# EAGLE design ripples_v90 (EAGLE 5.09)
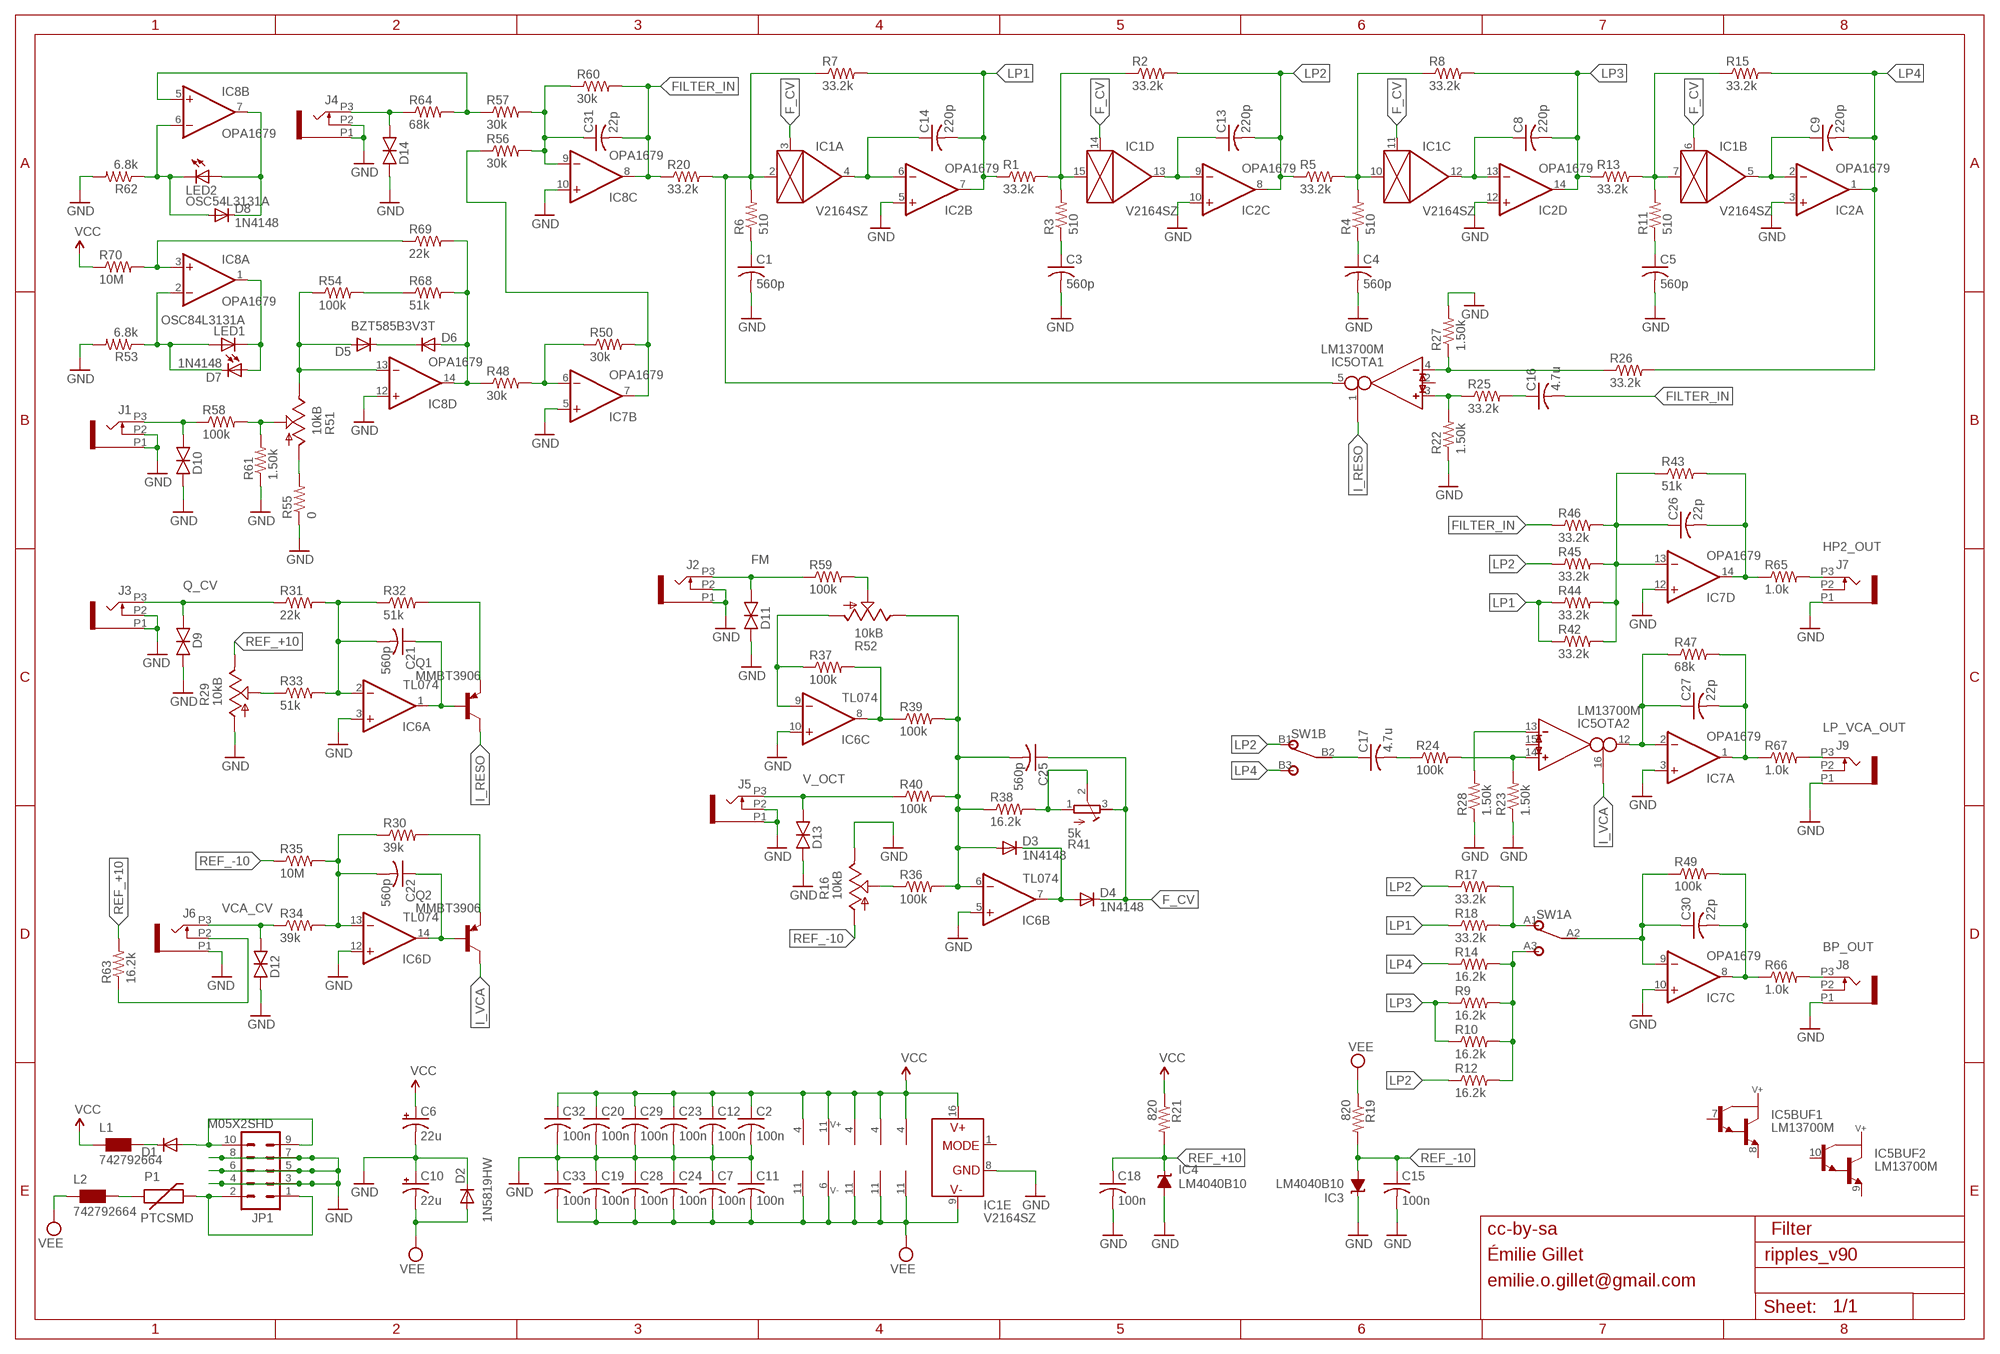
[diagram p0: schematic, sheet 1]

## Parts
C1  560p  C-USC0402  [C0402]
C2  100n  C-USC0402  [C0402]
C3  560p  C-USC0402  [C0402]
C4  560p  C-USC0402  [C0402]
C5  560p  C-USC0402  [C0402]
C6  22u  CPOL-USB  [PANASONIC_B]
C7  100n  C-USC0402  [C0402]
C8  220p  C-USC0603  [C0603]
C9  220p  C-USC0603  [C0603]
C10  22u  CPOL-USB  [PANASONIC_B]
C11  100n  C-USC0402  [C0402]
C12  100n  C-USC0402  [C0402]
C13  220p  C-USC0603  [C0603]
C14  220p  C-USC0603  [C0603]
C15  100n  C-USC0402  [C0402]
C16  4.7u  C-USC1206  [C1206]
C17  4.7u  C-USC1206  [C1206]
C18  100n  C-USC0402  [C0402]
C19  100n  C-USC0402  [C0402]
C20  100n  C-USC0402  [C0402]
C21  560p  C-USC0402  [C0402]
C22  560p  C-USC0402  [C0402]
C23  100n  C-USC0402  [C0402]
C24  100n  C-USC0402  [C0402]
C25  560p  C-USC0402  [C0402]
C26  22p  C-USC0402  [C0402]
C27  22p  C-USC0402  [C0402]
C28  100n  C-USC0402  [C0402]
C29  100n  C-USC0402  [C0402]
C30  22p  C-USC0402  [C0402]
C31  22p  C-USC0402  [C0402]
C32  100n  C-USC0402  [C0402]
C33  100n  C-USC0402  [C0402]
D1  1N5819HW  DIODE-SOD123  [SOD123]
D2  1N5819HW  DIODE-SOD123  [SOD123]
D3  1N4148  DIODE-SOD523  [SOD523]
D4  1N4148  DIODE-SOD523  [SOD523]
D5  BZT585B3V3T  DIODE-SOD523  [SOD523]
D6  BZT585B3V3T  DIODE-SOD523  [SOD523]
D7  1N4148  DIODE-SOD523  [SOD523]
D8  1N4148  DIODE-SOD523  [SOD523]
D9  TVS  [0603]
D10  TVS  [0603]
D11  TVS  [0603]
D12  TVS  [0603]
D13  TVS  [0603]
D14  TVS  [0603]
IC1  V2164SZ  SSM2164S  [SOIC16N]
IC2  OPA1679  OPA1679PW  [TSSOP14_065]
IC3  LM4040B10  LM4041B12DBZ  [DBZ_R-PDSO-G3]
IC4  LM4040B10  LM4041B12DBZ  [DBZ_R-PDSO-G3]
IC5  LM13700M  [SO16]
IC6  TL074  TL074PW  [TSSOP14_065]
IC7  OPA1679  OPA1679PW  [TSSOP14_065]
IC8  OPA1679  OPA1679PW  [TSSOP14_065]
J1  PJ301_THONKICONNTME  [WQP_PJ_301M_TME]
J2  PJ301_THONKICONNTME  [WQP_PJ_301M_TME]
J3  PJ301_THONKICONNTME  [WQP_PJ_301M_TME]
J4  PJ301_THONKICONNTME  [WQP_PJ_301M_TME]
J5  PJ301_THONKICONNTME  [WQP_PJ_301M_TME]
J6  PJ301_THONKICONNTME  [WQP_PJ_301M_TME]
J7  PJ301_THONKICONNTME  [WQP_PJ_301M_TME]
J8  PJ301_THONKICONNTME  [WQP_PJ_301M_TME]
J9  PJ301_THONKICONNTME  [WQP_PJ_301M_TME]
JP1  M05X2SHD  [2X5-SHROUDED]
L1  742792664  WE-CBF_0603  [0603]
L2  742792664  WE-CBF_0603  [0603]
LED1  OSC84L3131A  LED3MM  [LED3MM]
LED2  OSC54L3131A  LED3MM  [LED3MM]
P1  PTCSMD  [PTC-1206]
Q1  MMBT3906  MMBT3906LT1-PNP-SOT23-BEC  [SOT23-BEC]
Q2  MMBT3906  MMBT3906LT1-PNP-SOT23-BEC  [SOT23-BEC]
R1  33.2k  R-US_R0402  [R0402]
R2  33.2k  R-US_R0402  [R0402]
R3  510  R-US_R0402  [R0402]
R4  510  R-US_R0402  [R0402]
R5  33.2k  R-US_R0402  [R0402]
R6  510  R-US_R0402  [R0402]
R7  33.2k  R-US_R0402  [R0402]
R8  33.2k  R-US_R0402  [R0402]
R9  16.2k  R-US_R0402  [R0402]
R10  16.2k  R-US_R0402  [R0402]
R11  510  R-US_R0402  [R0402]
R12  16.2k  R-US_R0402  [R0402]
R13  33.2k  R-US_R0402  [R0402]
R14  16.2k  R-US_R0402  [R0402]
R15  33.2k  R-US_R0402  [R0402]
R16  10kB  POT_USVERTICAL_PS  [ALPS_POT_VERTICAL_PS]
R17  33.2k  R-US_R0402  [R0402]
R18  33.2k  R-US_R0402  [R0402]
R19  820  R-US_R0402  [R0402]
R20  33.2k  R-US_R0402  [R0402]
R21  820  R-US_R0402  [R0402]
R22  1.50k  R-US_R0402  [R0402]
R23  1.50k  R-US_R0402  [R0402]
R24  100k  R-US_R0402  [R0402]
R25  33.2k  R-US_R0402  [R0402]
R26  33.2k  R-US_R0402  [R0402]
R27  1.50k  R-US_R0402  [R0402]
R28  1.50k  R-US_R0402  [R0402]
R29  10kB  POT_USVERTICAL_PS  [ALPS_POT_VERTICAL_PS]
R30  39k  R-US_R0402  [R0402]
R31  22k  R-US_R0402  [R0402]
R32  51k  R-US_R0402  [R0402]
R33  51k  R-US_R0402  [R0402]
R34  39k  R-US_R0402  [R0402]
R35  10M  R-US_R0402  [R0402]
R36  100k  R-US_R0402  [R0402]
R37  100k  R-US_R0402  [R0402]
R38  16.2k  R-US_R0402  [R0402]
R39  100k  R-US_R0402  [R0402]
R40  100k  R-US_R0402  [R0402]
R41  5k  R-TRIMM3296X  [RTRIM3296X]
R42  33.2k  R-US_R0402  [R0402]
R43  51k  R-US_R0402  [R0402]
R44  33.2k  R-US_R0402  [R0402]
R45  33.2k  R-US_R0402  [R0402]
R46  33.2k  R-US_R0402  [R0402]
R47  68k  R-US_R0402  [R0402]
R48  30k  R-US_R0402  [R0402]
R49  100k  R-US_R0402  [R0402]
R50  30k  R-US_R0402  [R0402]
R51  10kB  POT_USVERTICAL_NARROW  [ALPS_POT_NARROW]
R52  10kB  POT_USVERTICAL_NARROW  [ALPS_POT_NARROW]
R53  6.8k  R-US_R0402  [R0402]
R54  100k  R-US_R0402  [R0402]
R55  0  R-US_R0402  [R0402]
R56  30k  R-US_R0402  [R0402]
R57  30k  R-US_R0402  [R0402]
R58  100k  R-US_R0402  [R0402]
R59  100k  R-US_R0402  [R0402]
R60  30k  R-US_R0402  [R0402]
R61  1.50k  R-US_R0402  [R0402]
R62  6.8k  R-US_R0402  [R0402]
R63  16.2k  R-US_R0402  [R0402]
R64  68k  R-US_R0402  [R0402]
R65  1.0k  R-US_R0603  [R0603]
R66  1.0k  R-US_R0603  [R0603]
R67  1.0k  R-US_R0603  [R0603]
R68  51k  R-US_R0402  [R0402]
R69  22k  R-US_R0402  [R0402]
R70  10M  R-US_R0402  [R0402]
SW1  S-ON-ON-ONSS70070F-0202  [SS70070F-0202]

## Nets
BP__OUT: C30.2 IC7.8(C:OUT) R49.2 R66.1
BP_OUT: J8.P3 R66.2
CLEAN_IN: IC8.5(B:+IN) R57.1 R64.2
CV_F_POT: R16.P$2(S) R36.1
DIRTY_IN: D6.A IC8.14(D:OUT) R48.1 R68.2 R69.2
F_CV: C25.1 D4.C IC1.3(A:CTRL) IC1.6(B:CTRL) IC1.11(C:CTRL) IC1.14(D:CTRL) R41.3(A)
FILTER_IN: C16.2 C31.2 IC8.8(C:OUT) R20.1 R46.1 R60.2
FM: D11.2(C) J2.P3 R59.1
GND: C1.2 C2.2 C3.2 C4.2 C5.2 C6.- C7.1 C10.+ C11.1 C12.2 C15.2 C18.2 C19.1 C20.2 C23.2 C24.1 C28.1 C29.2 C32.2 C33.1 D2.C D9.1(A) D10.1(A) D11.1(A) D12.1(A) D13.1(A) D14.1(A) IC1.8(E:GND) IC2.3(A:+IN) IC2.5(B:+IN) IC2.10(C:+IN) IC2.12(D:+IN) IC3.1(C) IC4.2(A) IC6.3(A:+IN) IC6.5(B:+IN) IC6.10(C:+IN) IC6.12(D:+IN) IC7.3(A:+IN) IC7.5(B:+IN) IC7.10(C:+IN) IC7.12(D:+IN) IC8.10(C:+IN) IC8.12(D:+IN) J1.P1 J1.P2 J2.P1 J2.P2 J3.P1 J3.P2 J4.P1 J4.P2 J5.P1 J5.P2 J6.P1 J7.P1 J8.P1 J9.P1 JP1.3 JP1.4 JP1.5 JP1.6 JP1.7 JP1.8 R16.P$1(E) R22.1 R23.1 R27.2 R28.1 R29.P$3(A) R53.2 R55.1 R61.1 R62.2
HP2__OUT: C26.2 IC7.14(D:OUT) R43.2 R65.1
HP2_OUT: J7.P3 R65.2
I_RESO: IC5.1(OTA1:I_BIAS) Q1.C
I_VCA: IC5.16(OTA2:I_BIAS) Q2.C
LP1: C14.2 IC2.7(B:OUT) R1.1 R7.2 R18.1 R42.1 R44.1
LP2: C13.2 IC2.8(C:OUT) R2.2 R5.1 R12.1 R17.1 R45.1 SW1.B1
LP3: C8.2 IC2.14(D:OUT) R8.2 R9.1 R10.1 R13.1
LP4: C9.2 IC2.1(A:OUT) R14.1 R15.2 R26.2 SW1.B3
LP_VARIABLE: C17.1 SW1.B2
LP_VCA__OUT: C27.2 IC7.1(A:OUT) R47.2 R67.1
LP_VCA_OUT: J9.P3 R67.2
N$1: IC6.8(C:OUT) R37.2 R39.1
N$2: C14.1 IC1.4(A:OUT) IC2.6(B:-IN)
N$3: IC1.15(D:IN) R1.2 R2.1 R3.2
N$4: R38.2 R41.1(E) R41.2(S)
N$5: IC7.6(B:-IN) R48.2 R50.1
N$6: D1.A JP1.9 JP1.10
N$7: C16.1 R25.2
N$8: C1.1 R6.1
N$9: C13.1 IC1.13(D:OUT) IC2.9(C:-IN)
N$10: IC1.2(A:IN) IC5.5(OTA1:OUT) R6.2 R7.1 R20.2
N$11: C3.1 R3.1
N$12: IC1.10(C:IN) R4.2 R5.2 R8.1
N$13: C8.1 IC1.12(C:OUT) IC2.13(D:-IN)
N$14: IC5.4(OTA1:IN_N) R26.1 R27.1
N$15: C4.1 R4.1
N$16: IC1.7(B:IN) R11.2 R13.2 R15.1
N$17: C9.1 IC1.5(B:OUT) IC2.2(A:-IN)
N$18: IC5.3(OTA1:IN_P) R22.2 R25.1
N$19: C5.1 R11.1
N$20: C26.1 IC7.13(D:-IN) R42.2 R43.1 R44.2 R45.2 R46.2
N$21: R52.P$2(S) R59.2
N$22: IC6.9(C:-IN) R37.1 R52.P$3(A)
N$23: C25.2 D3.A IC6.6(B:-IN) R36.2 R38.1 R39.2 R40.2 R52.P$1(E)
N$24: R29.P$2(S) R33.1
N$25: C22.2 IC6.13(D:-IN) R30.1 R34.2 R35.2
N$26: C21.2 IC6.2(A:-IN) R31.2 R32.1 R33.2
N$27: C21.1 IC6.1(A:OUT) Q1.B
N$28: Q1.E R32.2
N$29: J6.P2 R63.1
N$30: C22.1 IC6.14(D:OUT) Q2.B
N$31: Q2.E R30.2
N$32: R51.P$3(A) R55.2
N$33: D7.A IC8.1(A:OUT) LED1.K(C)
N$34: JP1.1 JP1.2 P1.2
N$35: R54.2 R68.1
N$36: D10.2(C) J1.P3 R58.1
N$37: D7.C IC8.2(A:-IN) LED1.A R53.1
N$38: D3.C D4.A IC6.7(B:OUT)
N$39: IC7.7(B:OUT) R50.2 R56.1
N$40: C30.1 IC7.9(C:-IN) R49.1 SW1.A2
N$41: IC8.3(A:+IN) R69.1 R70.2
N$42: IC5.14(OTA2:IN_P) R23.2 R24.2
N$43: C27.1 IC5.12(OTA2:OUT) IC7.2(A:-IN) R47.1
N$45: R51.P$2(S) R58.2 R61.2
N$46: D5.C D6.C
N$47: IC5.13(OTA2:IN_N) R28.2
N$48: D1.C L1.2
N$50: L2.2 P1.1
N$51: D14.2(C) J4.P3 R64.1
N$52: C31.1 IC8.9(C:-IN) R56.2 R57.2 R60.1
N$53: D8.C IC8.7(B:OUT) LED2.A
N$54: D8.A IC8.6(B:-IN) LED2.K(C) R62.1
N$57: R17.2 R18.2 SW1.A1
N$58: R9.2 R10.2 R12.2 R14.2 SW1.A3
N$68: C17.2 R24.1
N$108: D5.A IC8.13(D:-IN) R51.P$1(E) R54.1
Q_CV: D9.2(C) J3.P3 R31.1
REF_+10: C18.1 IC4.1(C) R21.2 R29.P$1(E) R63.2
REF_-10: C15.1 IC3.2(A) R16.P$3(A) R19.2 R35.1
V_OCT: D13.2(C) J5.P3 R40.1
VCA_CV: D12.2(C) J6.P3 R34.1
VCC: C2.1 C6.+ C12.1 C20.1 C23.1 C29.1 C32.1 IC1.16(E:V+) IC2.4(P:V+) IC5.11(SUPPLY:V+) IC6.4(P:V+) IC7.4(P:V+) IC8.4(P:V+) L1.1 R21.1 R70.1
VEE: C7.2 C10.- C11.2 C19.2 C24.2 C28.2 C33.2 D2.A IC1.9(E:V-) IC2.11(P:V-) IC5.6(SUPPLY:V-) IC6.11(P:V-) IC7.11(P:V-) IC8.11(P:V-) L2.1 R19.1
Unconnected: IC1.1(E:MODE) IC5.2(OTA1:I_DIODE) IC5.7(BUF1:B) IC5.8(BUF1:E) IC5.9(BUF2:E) IC5.10(BUF2:B) IC5.15(OTA2:I_DIODE) J7.P2 J8.P2 J9.P2

## Notes on the sheet
- cc-by-sa | Filter
- Émilie Gillet
- emilie.o.gillet@gmail.com

## Library data of the parts
C1-C5 C7-C9 C11-C33 = rcl:C-US: CAPACITOR, American symbol
C6 C10 = rcl:CPOL-US: POLARIZED CAPACITOR, American symbol
D1-D8 = diode:DIODE-: DIODE
D9-D14 = og-diodes:TVS
IC1 = ssm2164:SSM2164
IC2 IC7 IC8 = og-linear:OPA1679
IC3 IC4 = texas:LM4041: PRECISION MICROPOWER SHUNT VOLTAGE REFERENCE Source: http://focus.ti.com/lit/ds/slcs146e/slcs146e.pdf
IC5 = ota:LM13700: Dual OTA with buffers
IC6 = og-linear:TL074: OP AMP
J1-J9 = og-pj301:PJ301_THONKICONN
JP1 = og-header:M05X2: Header 5x2 Standard 10-pin dual row 0.1" header. Commonly used with AVR-ISP. Use with Spark Fun Electronics SKU: PRT-00778
L1 L2 = wuerth-elektronik:WE-CBF: SMD EMI Suppression Ferrite Beads - excellent anti-EMI properties - low DCR - impedances till 3000 ohms - rated current up to 6 A
LED1 LED2 = led:LED: LED OSRAM: - CHIPLED LG R971, LG N971, LY N971, LG Q971, LY Q971, LO R971, LY R971 LH N974, LH R974 LS Q976, LO Q976, LY Q976 LO Q996 - Hyper CHIPLED LW Q18S LB Q993, LB Q99A, LB R99A - SideLED LS A670, LO A670, LY A670, LG A670, LP A670 LB A673, LV A673, LT A673, LW A673 LH A674 LY A675 LS A676, LA A676, LO A676, LY A676, LW A676 LS A679, LY A679, LG A679 - Hyper Micro SIDELED® LS Y876, LA Y876, LO Y876, LY Y876 LT Y87S - SmartLED LW L88C, LW L88S LB L89C, LB L89S, LG L890 LS L89K, LO L89K, LY L89K LS L896, LA L896, LO L896, LY L896 - TOPLED LS T670, LO T670, LY T670, LG T670, LP T670 LSG T670, LSP T670, LSY T670, LOP T670, LYG T670 LG T671, LOG T671, LSG T671 LB T673, LV T673, LT T673, LW T673 LH T674 LS T676, LA T676, LO T676, LY T676, LB T676, LH T676, LSB T676, LW T676 LB T67C, LV T67C, LT T67C, LS T67K, LO T67K, LY T67K, LW E67C LS E67B, LA E67B, LO E67B, LY E67B, LB E67C, LV E67C, LT E67C LW T67C LS T679, LY T679, LG T679 LS T770, LO T770, LY T770, LG T770, LP T770 LB T773, LV T773, LT T773, LW T773 LH T774 LS E675, LA E675, LY E675, LS T675 LS T776, LA T776, LO T776, LY T776, LB T776 LHGB T686 LT T68C, LB T68C - Hyper Mini TOPLED® LB M676 - Mini TOPLED Santana® LG M470 LS M47K, LO M47K, LY M47K Source: http://www.osram.convergy.de LUXEON: - LUMILED® LXK2-PW12-R00, LXK2-PW12-S00, LXK2-PW14-U00, LXK2-PW14-V00 LXK2-PM12-R00, LXK2-PM12-S00, LXK2-PM14-U00 LXK2-PE12-Q00, LXK2-PE12-R00, LXK2-PE12-S00, LXK2-PE14-T00, LXK2-PE14-U00 LXK2-PB12-K00, LXK2-PB12-L00, LXK2-PB12-M00, LXK2-PB14-N00, LXK2-PB14-P00, LXK2-PB14-Q00 LXK2-PR12-L00, LXK2-PR12-M00, LXK2-PR14-Q00, LXK2-PR14-R00 LXK2-PD12-Q00, LXK2-PD12-R00, LXK2-PD12-S00 LXK2-PH12-R00, LXK2-PH12-S00 LXK2-PL12-P00, LXK2-PL12-Q00, LXK2-PL12-R00 Source: www.luxeon.com KINGBRIGHT: KA-3528ASYC Source: www.kingbright.com
P1 = SparkFun:PTC: Resettable Fuse PTC Resettable Fuse. Spark Fun Electronics SKU : COM-08357
Q1 Q2 = transistor:*-PNP-: PNP Transistror
R1-R15 R17 R18 R20-R28 R30-R40 R42-R50 R53-R70 = rcl:R-US_: RESISTOR, American symbol
R16 R29 R51 R52 = og-pots:POT_US
R19 = resistor:R-US_: RESISTOR, American symbol
R41 = rcl:R-TRIMM: Trimm resistor
SW1 = og-switch:S-ON-ON-ON

## Board
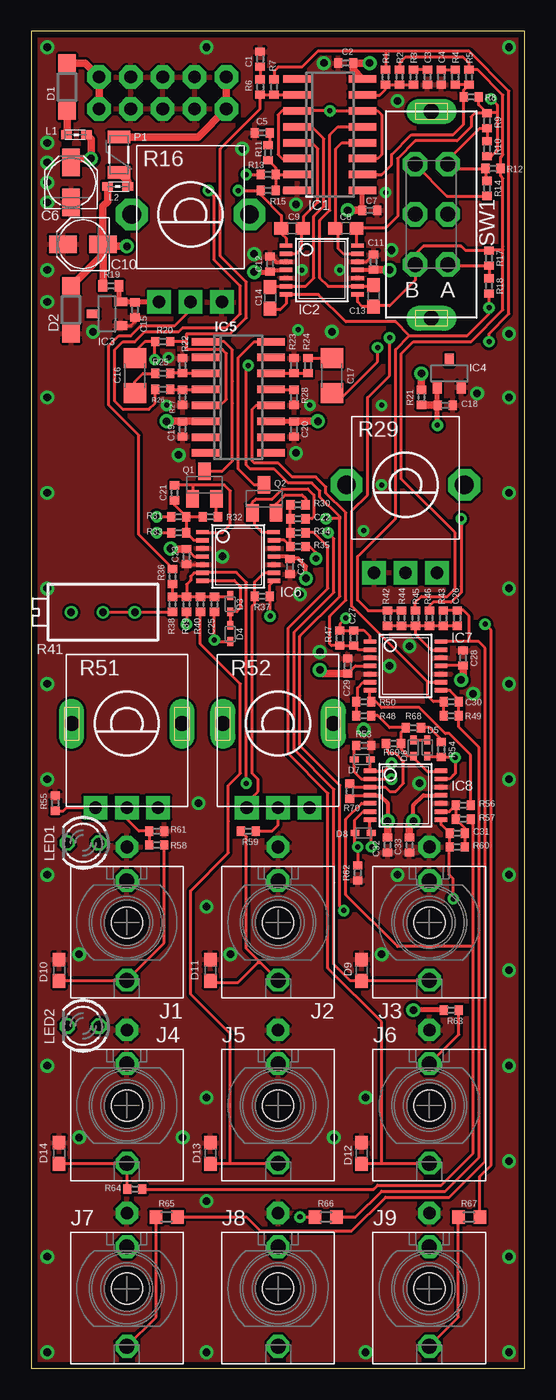
[diagram p1: board, top side]
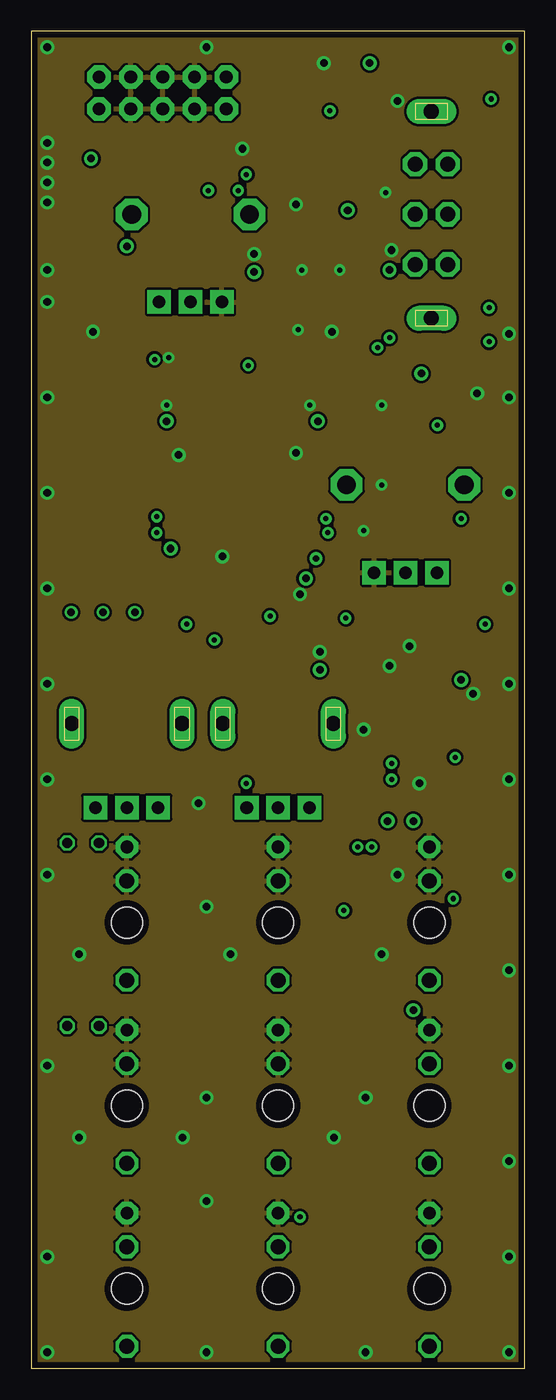
[diagram p2: board, inner layer InternalGround]
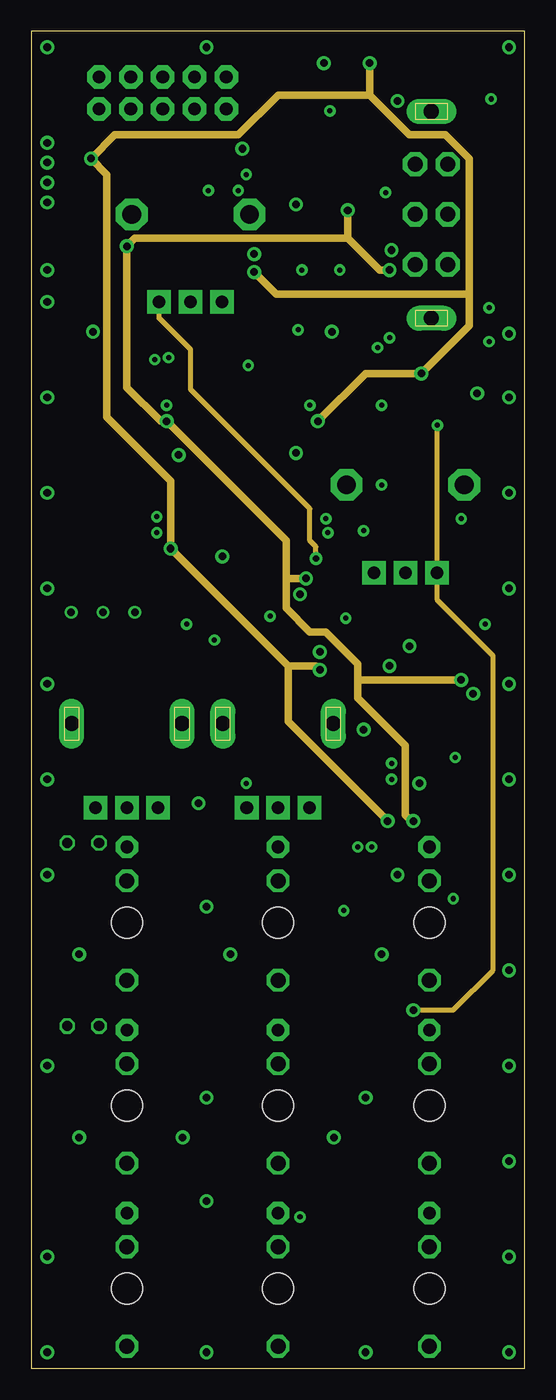
[diagram p3: board, inner layer Supplies]
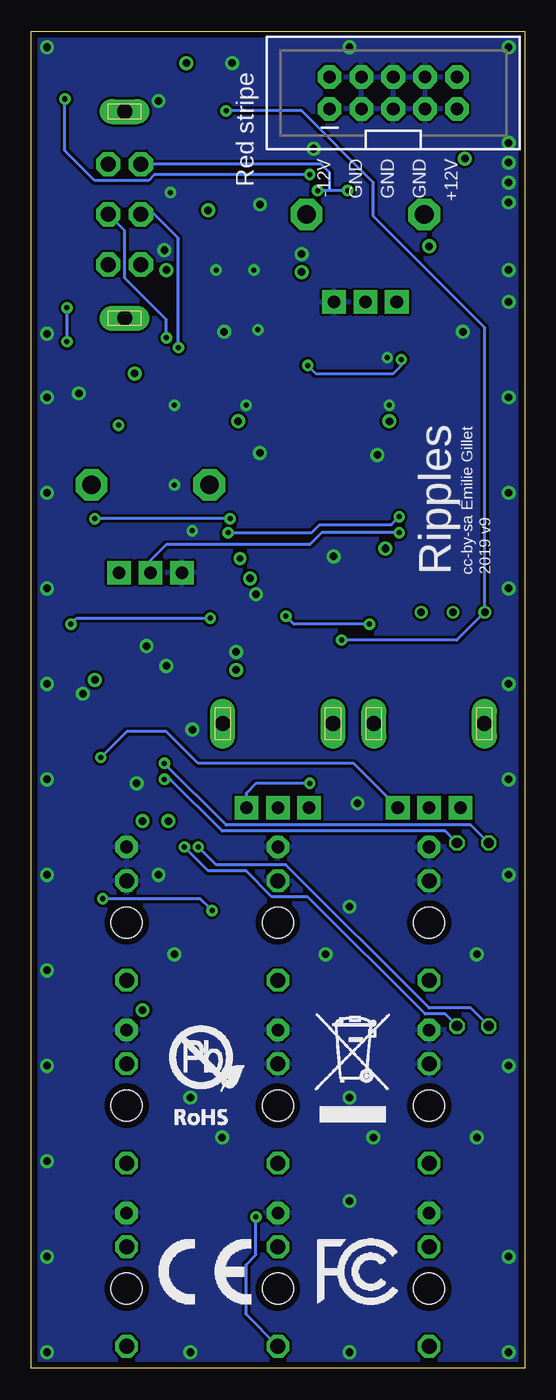
[diagram p4: board, bottom side, seen from below]

Size 39.35 x 106.68 mm. Coordinates in mm from the lower left corner, seen from the top.
Outline: 0,0 39.35,0 39.35,106.68 0,106.68 0,0
Copper layers (1+2*15+16): Top 0.05mm / dielectric 0.3mm / InternalGround 0.05mm / dielectric 0.75mm / Supplies 0.035mm / dielectric 0.2mm / Bottom 0.05mm
Design rules "PCBCart-Standard-4L *": minimum track width 8mil, minimum drill 0.3mm, track to track 8mil, track to pad 8mil, pad to pad 8mil, via to via 8mil, smd to smd 8mil, copper to edge 20mil, drill to drill 8mil, minimum pad ring 8mil, minimum via ring 10mil, stop-mask expansion 3mil, vias tented up to drill 25mil, thermal gap 8mil

### Footprints (pad centres in the part's own frame; a part is rotated, then mirrored left to right if it is on the bottom)
C0402 = smd 0.65 x 0.75: 1 -0.6,0; 2 0.6,0
PANASONIC_B = smd 2.2 x 1.4: + 1.6,0; - -1.6,0
C0603 = smd 1.1 x 1: 1 -0.85,0; 2 0.85,0
C1206 = smd 1.6 x 1.8: 1 -1.4,0; 2 1.4,0
SOD123 = smd 1.4 x 1.4: A 1.9,0; C -1.9,0
SOD523 = smd 0.7 x 0.5: A 0.7,0; C -0.6,0
0603 = smd 1.1 x 1: 1 -0.85,0; 2 0.85,0
SOIC16N = smd 0.6 x 2.2: 1 -4.445,-2.6; 2 -3.175,-2.6; 3 -1.905,-2.6; 4 -0.635,-2.6; 5 0.635,-2.6; 6 1.905,-2.6; 7 3.175,-2.6; 8 4.445,-2.6; 9 4.445,2.6; 10 3.175,2.6; 11 1.905,2.6; 12 0.635,2.6; 13 -0.635,2.6; 14 -1.905,2.6; 15 -3.175,2.6; 16 -4.445,2.6
TSSOP14_065 = smd 0.35 x 1: 1 -1.95,-2.845; 2 -1.3,-2.845; 3 -0.65,-2.845; 4 0,-2.845; 5 0.65,-2.845; 6 1.3,-2.845; 7 1.95,-2.845; 8 1.95,2.845; 9 1.3,2.845; 10 0.65,2.845; 11 0,2.845; 12 -0.65,2.845; 13 -1.3,2.845; 14 -1.95,2.825
DBZ_R-PDSO-G3 = smd 0.7 x 1: 1 -0.95,-1.1; 2 0.95,-1.1; 3 0,1.1
SO16 = smd 0.6 x 2.2: 1 -4.445,-2.6; 2 -3.175,-2.6; 3 -1.905,-2.6; 4 -0.635,-2.6; 5 0.635,-2.6; 6 1.905,-2.6; 7 3.175,-2.6; 8 4.445,-2.6; 9 4.445,2.6; 10 3.175,2.6; 11 1.905,2.6; 12 0.635,2.6; 13 -0.635,2.6; 14 -1.905,2.6; 15 -3.175,2.6; 16 -4.445,2.6
WQP_PJ_301M_TME = drill 1 pad 1.778 octagon: P1 0,-6.032 | drill 1.2 pad 1.778 octagon: P2 0,-3.334; P3 0,4.604 | hole 2.5: 0,0
2X5-SHROUDED = drill 1.016 pad 1.88 octagon: 1 -1.27,5.08; 2 1.27,5.08; 3 -1.27,2.54; 4 1.27,2.54; 5 -1.27,0; 6 1.27,0; 7 -1.27,-2.54; 8 1.27,-2.54; 9 -1.27,-5.08; 10 1.27,-5.08
0603' = smd 0.85 x 0.7: 1 -0.9,0; 2 0.7,0
LED3MM = drill 0.813 octagon: A -1.27,0; K 1.27,0
PTC-1206 = smd 1 x 1.8: 1 -1.4,0; 2 1.4,0
SOT23-BEC = smd 1 x 1.4: B -0.95,-1.1; C 0,1.1; E 0.95,-1.1
R0402 = smd 0.65 x 0.75: 1 -0.6,0; 2 0.6,0
ALPS_POT_VERTICAL_PS = drill 1 pad 1.88 square: P$1 -2.5,7; P$2 0,7; P$3 2.5,7 | drill 1.5 pad 2.54 octagon: P$4 -4.7,0; P$5 4.7,0
R0402' = smd 0.7 x 0.9: 1 -0.65,0; 2 0.65,0
RTRIM3296X = drill 0.61 round: 1 0,-2.54; 2 0,0; 3 0,2.54
ALPS_POT_NARROW = drill 1 pad 1.88 square: P$1 -2.5,6.7; P$2 0,6.7; P$3 2.5,6.7 | drill 1.2 pad 2 long: P$4 -4.4,0; P$5 4.4,0
R0603 = smd 1 x 1.1: 1 -0.85,0; 2 0.85,0
SS70070F-0202 = drill 1.2 pad 1.93 octagon: A1 -1.3,4; A2 -1.3,0; A3 -1.3,-4; B1 1.3,4; B2 1.3,0; B3 1.3,-4 | drill 1.2 pad 2 long: P$1 0,-8.21; P$4 0,8.3

### Placement (x,y rotation side)
C1  18.26,104.46 90 top
C2  25.08,104.14 180 top
C3  31.59,103.03 270 top
C4  32.7,103.03 270 top
C5  18.41,98.58 180 top
C6  3.17,94.61 90 top
C7  26.99,92.39 180 top
C8  25.08,90.96 0 top
C9  20.8,90.96 180 top
C10  4.13,89.69 180 top
C11  27.31,88.27 270 top
C12  19.05,88.11 90 top
C13  27.3,85.57 270 top
C14  19.05,85.41 270 top
C15  8.26,84.45 270 top
C16  8.26,79.22 90 top
C17  23.97,79.22 90 top
C18  33.02,76.83 0 top
C19  12.06,74.93 90 top
C20  20.95,74.93 270 top
C21  11.43,69.85 270 top
C22  21.27,67.79 180 top
C23  12.38,64.77 270 top
C24  20.64,63.98 90 top
C25  14.61,60.96 90 top
C26  33.97,59.85 90 top
C27  25.72,58.26 90 top
C28  34.45,56.67 270 top
C29  25.24,56.04 90 top
C30  33.5,53.18 0 top
C31  33.97,42.7 180 top
C32  28.42,41.75 270 top
C33  30.16,41.75 90 top
D1  2.86,102.23 90 top
D2  3.17,84.45 90 top
D3  15.88,60.96 90 top
D4  15.88,58.58 90 top
D5  31.59,49.53 270 top
D6  30.48,49.53 270 top
D7  26.35,48.58 0 top
D8  26.51,42.7 180 top
D9  26.35,31.75 270 top
D10  2.22,31.75 270 top
D11  14.29,31.75 270 top
D12  26.35,17.15 270 top
D13  14.29,17.14 270 top
D14  2.22,17.14 270 top
IC1  23.81,98.42 270 top
IC2  23.18,87.63 270 top
IC3  6.03,84.14 90 top
IC4  33.34,79.38 0 top
IC5  16.51,77.47 270 top
IC6  16.51,64.77 270 top
IC7  29.84,56.04 270 top
IC8  29.84,45.72 270 top
J1  7.62,35.56 180 top
J2  19.68,35.56 180 top
J3  31.75,35.56 180 top
J4  7.62,20.95 180 top
J5  19.68,20.95 180 top
J6  31.75,20.95 180 top
J7  7.62,6.35 180 top
J8  19.68,6.35 180 top
J9  31.75,6.35 180 top
JP1  10.48,101.76 90 bottom
L1  742792664  [0603']  3.49,98.43 180 top
L2  742792664  [0603']  6.99,94.3 0 top
LED1  4.13,41.91 180 top
LED2  4.13,27.3 180 top
P1  6.99,96.84 90 top
Q1  13.81,70.48 0 top
Q2  18.57,69.37 0 top
R1  28.26,103.03 270 top
R2  29.37,103.03 90 top
R3  30.48,103.03 270 top
R4  33.81,103.03 270 top
R5  34.92,103.03 270 top
R6  18.26,102.24 270 top
R7  19.37,102.23 90 top
R8  35.08,101.44 0 top
R9  36.35,99.54 270 top
R10  36.35,97.31 90 top
R11  18.89,97 270 top
R12  36.83,95.73 180 top
R13  18.89,95.25 0 top
R14  36.35,94.14 90 top
R15  18.89,93.98 180 top
R16  12.7,92.08 180 top
R17  36.51,88.58 270 top
R18  36.51,86.36 90 top
R19  820  [R0402']  6.35,86.36 0 top
R20  10.48,81.92 0 top
R21  31.11,77.47 270 top
R22  12.06,80.01 270 top
R23  20.95,80.01 270 top
R24  22.07,80.01 270 top
R25  10.48,79.38 180 top
R26  10.48,78.11 180 top
R27  12.06,77.47 270 top
R28  20.95,77.47 90 top
R29  29.84,70.48 180 top
R30  21.27,68.9 0 top
R31  11.75,67.94 0 top
R32  14.29,67.94 0 top
R33  11.75,66.67 0 top
R34  21.27,66.67 180 top
R35  21.27,65.56 180 top
R36  11.27,63.18 270 top
R37  18.41,61.59 0 top
R38  11.27,60.96 270 top
R39  12.38,60.96 90 top
R40  13.49,60.96 90 top
R41  5.71,60.33 90 top
R42  28.42,59.85 270 top
R43  32.86,59.85 90 top
R44  29.53,59.85 270 top
R45  30.64,59.85 270 top
R46  31.75,59.85 270 top
R47  24.61,58.26 90 top
R48  26.51,52.07 180 top
R49  33.5,52.07 0 top
R50  26.51,53.18 0 top
R51  7.62,51.44 180 top
R52  19.68,51.44 180 top
R53  26.51,49.69 0 top
R54  32.7,49.37 90 top
R55  1.91,45.09 270 top
R56  34.45,44.93 180 top
R57  34.45,43.82 180 top
R58  10,41.75 180 top
R59  17.3,42.86 0 top
R60  33.97,41.59 180 top
R61  10,42.86 180 top
R62  26.04,39.53 270 top
R63  33.5,28.57 180 top
R64  8.26,14.29 0 top
R65  10.79,12.06 180 top
R66  23.5,12.06 180 top
R67  34.92,12.06 180 top
R68  30.48,51.12 180 top
R69  28.89,49.85 0 top
R70  25.4,46.04 90 top
SW1  31.91,92.08 180 top
U$1  [CE_MEDIUM]  29.21,5.08 0 bottom
U$2  [FCC_MEDIUM]  16.51,5.08 0 bottom
U$3  [ROHS_LOGO]  27.94,19.37 0 bottom
U$4  [TRASHCAN_LOGO]  16.51,19.37 0 bottom

### Tracks (layer width: path | path; a pad name or v marks a point on that pad's centre or on a via)
BP__OUT
  Top 0.254: R66.1 25.88,12.06 27.94,14.13 33.02,14.13 35.72,16.83 | 32.7,54.08 IC7.8 33.38,54.09 33.97,53.5 33.97,53.3 C30.2 R49.2 | 35.72,16.83 | R49.2 | R49.2 34.1,51.15 35.72,49.53 35.72,18.26 35.72,16.83
BP_OUT  (via drill 0.4)
  Top 0.254: v21.43,12.06 R66.2
  Bottom 0.254: v21.43,12.06 21.43,9.05 22.23,8.26 22.23,4.29 J8.P3
CLEAN_IN
  Top 0.254: 35.24,43.62 R57.1 35.05,43.53 35.24,43.34 35.24,33.66 | IC8.5 26.34,45.07 25.08,43.81 25.08,37.78 29.21,33.66 35.24,33.66 | R64.2 27.3,14.29 27.62,14.61 32.7,14.61 35.24,17.14 35.24,33.66
CV_F_POT
  Top 0.254: R36.1 11.27,63.82 10.32,64.77 8.57,66.52 8.57,74.45 6.19,76.83 6.19,81.6 6.99,82.39 7.94,82.39 8.73,83.19 11.43,83.19 12.7,84.45 R16.P$2
DIRTY_IN
  Top 0.254: R48.1 | R48.1 27.62,52.07 28.57,51.12 R68.2 29.49,50.73 R69.2 29.49,49.41 30,48.9 30.41,48.9 D6.A 30.48,48.74 31.59,47.62 32.62,47.62 IC8.14
F_CV  (via drill 0.4)
  Top 0.254: IC1.6 20,96.52 19.68,96.84 19.68,100.01 20,100.33 IC1.3 v23.81,100.33 IC1.14 27.62,100.33 27.94,100.01 27.94,96.84 27.62,96.52 IC1.11 | v14.61,58.1 | v14.61,58.1 C25.1 | v14.61,58.1 14.73,57.98 D4.C
  Bottom 0.254: v23.81,100.33 17.78,100.33 12.06,94.61 12.06,91.92 3.17,83.03 R41.3 5.4,58.1 v14.61,58.1
FILTER_IN  (via drill 0.4)
  Top 0.254: v17.3,80.01 17.14,79.85 17.14,72.07 17.46,71.75 19.37,71.75 20.48,70.64 22.38,70.64 23.02,70.01 23.02,69.53 24.61,67.94 | 24.61,67.94 24.61,61.59 21.43,58.42 21.43,53.66 21.43,49.69 24.61,46.51 24.61,36.83 v24.92,36.51 | v33.66,37.47 33.66,39.05 33.34,39.37 33.34,41.56 R60.2 | 32.7,43.76 IC8.8 32.69,43.39 C31.2 | C31.2 33.34,42.7 | R60.2 | R60.2 C31.2 | C16.2 8.26,81.12 9.05,81.92 R20.1 9.84,81.88 v9.84,80.49 | v34.29,67.79 34.29,62.39 | 34.29,62.39 34.29,61.91 | v23.5,67.79 23.65,67.79 23.97,67.79 24.61,67.79 24.61,67.94 | R46.1 | R46.1 31.75,60.8 32.07,61.12 33.5,61.12 34.29,61.91 | 34.29,62.39 34.29,61.91
  Bottom 0.254: v17.3,80.01 16.67,79.38 10.48,79.38 9.84,80.01 v9.84,80.49 | v33.66,37.47 25.88,37.47 25.08,36.67 v24.92,36.51 | v34.29,67.79 34.13,67.79 v23.5,67.79
FM
  Top 0.254: R59.1 17.14,42.42 17.14,33.5 18.26,32.38 | 18.26,32.38 J2.P3 | D11.2 14.39,30.8 16.51,30.8 18.1,32.38 18.26,32.38
GND  (via drill 0.4, 0.6)
  Top 0.254: C23.2 12.43,64.12 IC6.5 | C11.1 26.72,88.28 IC2.12 | IC3.1 7.94,83.19 8.26,83.5 C15.2
  Top 0.305: 19.05,88.74 19.53,88.27 20.32,88.27
  other vias: 21.27,82.87 22.23,76.83 21.11,73.03 11.75,72.87 10.95,80.64 10.8,76.83 23.97,82.71 1.27,93.03 1.27,94.61 35.56,77.79 28.57,56.04 30.16,57.63 4.92,82.71 21.43,61.75 15.24,64.77 1.27,96.2 38.1,105.41 38.1,82.55 38.1,77.47 38.1,69.85 38.1,62.23 38.1,54.61 38.1,46.99 38.1,39.37 38.1,31.75 38.1,24.13 38.1,16.51 38.1,8.89 38.1,1.27 26.67,1.27 13.97,1.27 1.27,1.27 1.27,8.89 1.27,24.13 1.27,54.61 1.27,62.23 1.27,77.47 1.27,87.63 1.27,105.41 1.27,97.79 13.97,105.41 13.97,21.59 26.67,21.59 13.97,13.34 13.97,36.83 23.34,104.14 21.59,87.63 24.61,87.63 21.11,92.87 28.73,89.22 17.78,88.9 28.26,93.82 29.21,101.12 16.83,97.31 1.27,69.85 1.27,85.09 23.02,57.15 29.21,39.37 26.51,50.96 1.27,46.99 1.27,39.37 30.96,46.67 27.94,33.02 35.24,53.82 13.34,45.09 15.88,33.02 3.81,33.02 3.81,18.41 12.06,18.41 24.13,18.41 27.94,76.83 26.51,66.83 27.94,70.48
  pour Bottom: 0,106.68 0,0 39.37,0 39.37,106.68
  pour Top: 0,106.68 0,0 39.37,0 39.37,106.68
  pour InternalGround: 0,106.68 0,0 39.37,0 39.37,106.68
HP2__OUT
  Top 0.254: R65.1 17.14,12.06 18.26,10.95 25.56,10.95 28.26,13.65 33.34,13.65 36.2,16.51 36.2,16.67 36.2,57.47 35.67,57.99 34.92,57.99 | 34.92,57.99 IC7.14 | C26.2 | C26.2 33.97,60.48 34.45,60.48 34.92,60.01 34.92,57.99 | C26.2 R43.2
HP2_OUT
  Top 0.254: J7.P3 9.95,4.07 R65.2
I_RESO
  Top 0.254: Q1.C 13.82,71.6 15.24,71.6 16.03,72.39 16.03,76.99 16.03,78.74 16.03,81.28 15.4,81.92 IC5.1
I_VCA
  Top 0.254: 19.21,81.92 IC5.16 17.78,81.92 16.51,80.64 16.51,71.75 17.78,70.48 18.56,70.48 Q2.C
LP1  (via drill 0.4)
  Top 0.254: 19.33,102.87 R7.2 19.37,103.5 19.68,103.82 21.59,103.82 22.86,105.09 28.26,105.09 | 28.26,105.09 R1.1 | 28.26,105.09 34.92,105.09 38.1,101.92 38.1,84.14 36.51,82.55 v36.51,81.92 | C14.2 19.15,84.45 19.84,84.45 20.33,84.94 IC2.7 | IC2.7 20.38,85.72 | R18.1 v36.51,84.61 36.51,84.14 34.77,82.39 30.16,82.39 | 30.16,82.39 29.05,81.28 29.05,67.79 26.04,64.77 26.04,61.28 26.86,60.45 R42.1 | R42.1 | R42.1 R44.1 | 30.16,82.39 29.05,83.5 25.08,83.5 22.91,85.68 IC2.7
  Bottom 0.254: v36.51,84.61 v36.51,81.92
LP2
  Top 0.254: 29.37,104.14 29.84,104.62 32.23,104.62 | IC2.8 26.04,85.67 26.04,85.09 26.41,84.72 C13.2 27.36,84.77 28.57,84.77 30.61,86.81 SW1.B1 30.64,88.11 30.64,88.9 31.27,89.53 34.29,89.53 34.64,89.18 R17.1 36.55,89.22 37.62,89.22 | 32.23,104.62 | 32.23,104.62 34.45,104.62 34.92,104.14 R5.1 35.59,103.63 37.62,101.6 37.62,96.84 37.43,96.64 R12.1 37.43,95.13 37.62,94.93 37.62,89.53 37.62,89.22 | 29.37,104.14 | 29.37,104.14 R2.2 | R45.1 30.64,61.12 31.11,61.59 33.18,61.59 33.81,62.23 33.81,66.67 29.53,70.96 29.53,80.96 30.48,81.92 35.08,81.92 37.62,84.45 37.62,89.22
LP3  (via drill 0.4)
  Top 0.254: IC2.14 25.93,89.65 C8.2 | C8.2 | C8.2 28.26,90.96 29.21,91.92 29.21,96.52 30.64,97.95 33.97,97.95 35.08,99.06 35.08,99.85 35.37,100.14 R9.1 | R8.2 35.68,100.81 R9.1 | v36.67,101.28 37.15,100.81 37.15,100.17 | 37.15,100.17 37.15,97.16 36.71,96.71 R10.1 | R9.1 36.39,100.17 37.15,100.17 | R13.1 | v17.14,95.25 R13.1
  Bottom 0.254: v17.14,95.25 29.53,95.25 30,94.77 34.29,94.77 36.67,97.16 v36.67,101.28
LP4  (via drill 0.4)
  Top 0.254: 9.37,82.71 11.75,82.71 12.06,83.03 15.56,83.03 16.67,84.14 16.67,86.36 14.61,88.42 14.61,93.5 v14.13,93.98 | 9.37,82.71 | v16.51,93.98 R15.2 18.29,93.63 19.95,91.97 C9.2 19.95,90.54 20.32,90.17 20.32,89.59 IC2.1 | 9.37,82.71 9.05,82.71 8.26,81.92 7.3,81.92 6.67,81.28 6.67,77.15 7.3,76.52 9.37,76.52 9.88,77.03 R26.2 | SW1.B3 33.15,93.54 R14.1
  Bottom 0.254: v14.13,93.98 15.56,93.98 | 15.56,93.98 v16.51,93.98 | 15.56,93.98 15.56,95.41 16.22,96.08 SW1.B3
LP_VARIABLE  (via drill 0.4)
  Top 0.254: C17.1 24.16,77.63 24.92,77.63 27.62,80.33 v27.62,81.44
  Bottom 0.254: v27.62,81.44 27.62,89.06 27.62,90.17 29.53,92.08 SW1.B2
LP_VCA__OUT  (via drill 0.4)
  Top 0.254: 26.95,57.94 IC7.1 27,58.41 26.51,58.9 26.19,58.9 25.75,58.9 C27.2 R47.2 | R67.1 35.77,15.3 36.67,16.19 36.67,49.37 36.67,50.01 36.67,58.42 | 36.67,58.42 36.67,58.74 | R47.2 | 36.67,58.42 36.67,58.74 | 36.67,58.74 36.67,58.9 v36.2,59.37 | v36.2,59.37 | v25.08,59.85 24.61,59.37 R47.2
  Bottom 0.254: v36.2,59.37 35.72,59.85 v25.08,59.85
LP_VCA_OUT
  Top 0.254: J9.P3 34.08,4.07 R67.2
N$1  (via drill 0.4)
  Top 0.254: IC6.8 19.02,62.48 R37.2 19.05,61.56 v19.05,60.01 | R39.1 v12.38,59.37
  Bottom 0.254: v12.38,59.37 18.41,59.37 v19.05,60.01
N$2
  Top 0.254: IC1.4 22.38,99.06 23.34,98.11 23.34,92.71 22.54,91.92 22.54,87 21.88,86.33 IC2.6 19.12,86.33 C14.1
N$3
  Top 0.254: R1.2 | IC1.15 27.78,101.6 28.26,102.08 R1.2 | R1.2 R2.1 R3.2
N$4
  Top 0.254: R41.2 R41.1 11.24,60.33 R38.2
N$5
  Top 0.254: 26.97,54.77 IC7.6 26.48,54.74 26.04,54.29 26.04,53.3 R50.1 R48.2
N$6
  Top 0.61: JP1.9 JP1.10 4.29,104.14 D1.A
N$7
  Top 0.254: 9.84,79.41 R25.2 8.89,79.38 8.26,78.74 C16.1
N$8
  Top 0.254: C1.1 R6.1
N$9
  Top 0.254: IC1.13 24.45,99.06 23.81,98.42 23.81,92.39 23.02,91.6 23.02,87 | 23.02,87 23.68,86.33 IC2.9 27.22,86.33 C13.1 | 23.02,87
N$10
  Top 0.254: IC5.5 15.08,76.83 15.56,77.31 15.56,80.96 15.24,81.28 12.38,81.28 12.38,81.92 | 12.38,81.92 R20.2 | 12.38,81.92 12.38,82.55 15.88,82.55 17.14,83.82 17.14,86.68 15.08,88.74 15.08,97.31 18.26,100.49 R6.2 | IC1.2 | IC1.2 21.18,101.64 R7.1 19.33,101.6 19.3,101.64 R6.2 | R6.2
N$11
  Top 0.254: C3.1 R3.1
N$12
  Top 0.254: IC1.10 27.62,95.25 27.94,95.25 28.73,96.04 28.73,96.84 30.32,98.42 30.8,98.42 33.66,98.42 34.48,99.25 R8.1 34.48,101.99 R5.2 | R5.2 R4.2 | R5.2
N$13
  Top 0.254: IC2.13 24.89,88.93 24.45,89.38 24.45,90.75 C8.1 24.29,91.02 24.29,97.31 24.77,97.79 IC1.12
N$14
  Top 0.254: R26.1 11.11,78.07 R27.1 12.1,78.11 IC5.4
N$15
  Top 0.254: C4.1 R4.1
N$16
  Top 0.254: R13.2 R15.1 | R13.2 | R13.2 IC1.7 | R11.2 19.49,95.8 R13.2
N$17
  Top 0.254: IC1.5 22.38,97.79 22.86,97.31 22.86,93.03 21.75,91.92 21.75,91.07 C9.1 21.59,90.91 21.59,89.38 21.14,88.93 IC2.2
N$18
  Top 0.254: R25.1 11.11,79.41 R22.2 13.88,79.41 IC5.3
N$19
  Top 0.254: 18.89,97.51 R11.1 19.02,97.72 C5.1
N$20
  Top 0.254: R42.2 | R42.2 R44.2 R45.2 | R46.2 | R46.2 R43.1 C26.1 | IC7.13 32.66,57.31 31.91,57.31 30.64,58.58 R45.2 | R46.2 | R45.2 R46.2
N$21
  Top 0.254: R59.2 19.21,42.86 19.68,43.34 R52.P$2
N$22
  Top 0.254: IC6.9 19.32,63.5 18.57,63.5 17.82,62.74 R37.1 17.82,60.99 17.62,60.8 17.62,47.47 18.1,46.99 18.1,46.04 17.14,45.09 17.14,44.77 R52.P$3
N$23  (via drill 0.4)
  Top 0.254: R39.2 R38.1 R36.2 | R39.2 R40.2 C25.2 15.78,61.56 D3.A | R39.2 12.35,61.59 12.38,61.63 12.38,62.55 12.7,62.87 12.7,63.18 12.99,63.47 IC6.6 13.7,63.5 16.35,63.5 17.14,62.71 v17.14,46.67 | R36.2 11.31,62.55 | R36.2 11.24,62.55
  Bottom 0.254: R52.P$1 22.23,44.77 22.23,45.88 21.43,46.67 v17.14,46.67
N$24  (via drill 0.4)
  Top 0.254: v10,66.67 R33.1
  Bottom 0.254: v10,66.67 16.19,66.67 17.14,65.72 28.57,65.72 29.84,64.45 R29.P$2
N$25
  Top 0.254: R30.1 C22.2 R34.2 | R35.2 | R35.2 R34.2 | R34.2 | R35.2 20.17,66.07 IC6.13
N$26
  Top 0.254: 13.65,66.04 13.65,66.06 IC6.2 12.95,66.07 R33.2 R31.2 | R31.2 R32.1 | R31.2 11.43,68.86 C21.2
N$27
  Top 0.254: IC6.1 13.71,66.67 15.24,66.67 15.88,67.31 15.88,70.01 15.4,70.48 12.86,70.48 | C21.1 11.46,70.48 12.86,70.48 | Q1.B 12.86,70.48
N$28
  Top 0.254: R32.2 14.76,68.07 Q1.E
N$29
  Top 0.254: J6.P2 34.1,26.64 R63.1
N$30
  Top 0.254: IC6.14 18.37,66.72 17.78,67.31 17.78,68.12 Q2.B 17.62,69.06 17.94,69.37 19.21,69.37 20,70.17 22.07,70.17 22.54,69.69 22.54,67.94 22.38,67.79 C22.1
N$31
  Top 0.254: 21.91,68.93 R30.2 21.87,69.41 21.59,69.69 20.24,69.69 19.52,68.97 Q2.E
N$32
  Top 0.254: R55.2 1.94,44.45 2.54,44.45 2.83,44.73 R51.P$3
N$33  (via drill 0.4)
  Top 0.254: D7.A 27.05,47.72 IC8.1 27.05,47.62 28.1,47.62 v28.73,48.26
  Bottom 0.254: LED1.K 4.29,43.34 23.81,43.34 v28.73,48.26 | v28.73,48.26
N$34
  Top 0.61: JP1.2 JP1.1 13.31,98.24 P1.2
N$35
  Top 0.254: R54.2 32.7,50.16 31.75,51.12 R68.1
N$36
  Top 0.254: D10.2 2.28,30.96 J1.P3 10.6,33.94 R58.1
N$37  (via drill 0.4)
  Top 0.254: 26.97,46.99 IC8.2 | v28.73,46.99 26.97,46.99 | 26.97,46.99 26.35,46.99 25.75,47.59 D7.C 25.75,49.53 R53.1
  Bottom 0.254: LED1.A 6.35,42.86 24.13,42.86 28.26,46.99 v28.73,46.99
N$38
  Top 0.254: IC6.7 13.71,62.87 16.19,62.87 16.67,62.39 16.67,60.64 16.39,60.36 D3.C D4.A
N$39
  Top 0.254: IC7.7 27,53.29 R50.2 27.46,53.18 27.94,52.7 30.96,52.7 33.02,50.64 33.34,50.64 35.05,48.93 R56.1
N$40  (via drill 0.4)
  Top 0.254: 31.62,54.74 25.56,60.8 25.56,68.42 26.83,69.69 26.83,77.47 28.57,79.22 v28.57,82.23 | 31.62,54.74 IC7.9 | 31.62,54.74 31.62,53.63 32.07,53.18 C30.1 R49.1 | R49.1
  Bottom 0.254: SW1.A2 31.91,90.78 31.91,87 28.57,83.66 v28.57,82.23
N$41
  Top 0.254: R69.1 28.42,49.72 28.42,49.21 28.57,49.05 29.05,49.05 29.69,48.42 29.69,46.67 29.05,46.04 28.57,46.04 28.24,46.37 IC8.3 25.67,46.37 R70.2
N$42
  Top 0.254: IC5.14 19.14,79.41 R23.2 R24.2
N$43
  Top 0.254: 26.99,57.33 IC7.2 26.04,57.34 C27.1 R47.1 | IC5.12 17.94,76.83 17.62,76.52 17.62,72.39 17.78,72.23 19.68,72.23 20.8,71.12 22.7,71.12 23.5,70.33 23.5,69.85 25.08,68.26 25.08,61.28 23.81,60.01 23.81,58.1 23.81,57.78 23.94,57.66 R47.1 | R47.1
N$45
  Top 0.254: R51.P$2 7.62,43.81 8.57,42.86 R61.2 R58.2
N$46
  Top 0.254: D6.C | D6.C D5.C
N$47
  Top 0.254: IC5.13 20.95,78.11 R28.2
N$48
  Top 0.61: L1.2 2.86,98.49 D1.C
N$50
  Top 0.61: P1.1 7.68,94.74 L2.2
N$51
  Top 0.254: R64.1 7.62,14.32 J4.P3 2.28,16.35 D14.2
N$52
  Top 0.254: R60.1 C31.1 34.57,43.09 R57.2 R56.2 33.34,44.42 IC8.9
N$53  (via drill 0.4)
  Top 0.254: v27.15,41.59 27.11,41.63 D8.C 27,42.81 IC8.7
  Bottom 0.254: LED2.A 6.35,28.26 7.94,28.26 17.3,37.62 20.16,37.62 22.23,39.69 25.24,39.69 v27.15,41.59 | v27.15,41.59
N$54  (via drill 0.4)
  Top 0.254: IC8.6 26.97,44.45 26.51,44.45 25.81,43.75 D8.A 25.81,41.82 v26.04,41.59 R62.1 | R62.1
  Bottom 0.254: v26.04,41.59 24.61,40.16 19.05,40.16 7.62,28.73 4.29,28.73 LED2.K
N$57
  Top 0.254: R18.2 | R18.2 R17.2 33.3,87.98 SW1.A1
N$58
  Top 0.254: R10.2 | R10.2 | R10.2 R9.2 35.75,98.94 35.72,98.9 33.21,96.39 SW1.A3 33.56,95.73 R12.2 36.23,94.86 R14.2
N$68
  Top 0.254: R24.1 C17.2
N$108  (via drill 0.4)
  Top 0.254: IC8.13 33.37,47.02 33.66,47.31 33.81,47.47 v33.81,48.74 | v33.81,48.74 | v33.81,48.74 32.74,48.74 R54.1 31.65,48.77 D5.A
  Bottom 0.254: R51.P$1 13.64,48.26 26.04,48.26 28.57,50.8 31.75,50.8 v33.81,48.74
Q_CV  (via drill 0.4)
  Top 0.254: 24.13,38.73 24.13,46.2 20.95,49.37 20.95,58.74 24.13,61.91 24.13,66.2 v23.65,66.67 | v10,67.94 R31.1 | 24.13,38.73 | J3.P3 26.41,30.96 D9.2 26.3,30.96 25.4,30.96 24.13,32.23 24.13,38.73
  Bottom 0.254: v10,67.94 10.64,67.31 16.35,67.31 16.99,66.67 v23.65,66.67
REF_+10  (via drill 0.4, 0.6)
  Top 0.254: C18.1 32.39,76.87 | IC4.1 32.35,78.31
  Top 0.406: 32.39,76.87 IC4.1 | C18.1 32.38,76.8 v32.38,75.25 | R63.2 v30.48,28.57
  Top 0.61: R21.2 31.15,76.83 C18.1
  Supplies 0.406: v30.48,28.57 33.66,28.57 36.83,31.75 36.83,56.83 32.38,61.28 32.38,63.45 R29.P$1 32.38,63.52 v32.38,75.25
REF_-10  (via drill 0.5)
  Top 0.254: R35.1 22.23,65.56 22.7,65.09 v22.7,64.61
  Top 0.406: R16.P$3 8.28,85.08 C15.1 7.17,85.06 IC3.2 7,85.22 R19.2
  Supplies 0.406: v22.7,64.61 22.7,64.77 22.7,65.56 22.23,66.04 22.23,68.58 12.7,78.11 12.7,81.28 10.2,83.78 R16.P$3
V_OCT
  Top 0.254: 15.72,43.66 | 15.72,43.66 15.72,46.51 16.67,47.47 16.67,54.61 13.49,57.78 R40.1 | 15.72,43.66 15.72,41.12 12.7,38.1 12.7,29.84 15.88,26.67 15.88,16.35 | D13.2 14.34,16.35 15.88,16.35 | 15.88,16.35 J5.P3
VCA_CV
  Top 0.254: R34.1 22.54,66.67 23.65,65.56 23.65,62.23 20.48,59.05 20.48,49.05 23.65,45.88 23.65,31.91 27.94,27.62 27.94,16.35 | D12.2 26.41,16.35 27.94,16.35 | 27.94,16.35 J6.P3
VCC  (via drill 0.6)
  Top 0.254: C29.1 25.84,56.04 IC7.4 | C23.1 12.98,64.77 IC6.4 | R70.1 25.68,45.72 IC8.4
  Top 0.305: C12.1 19.17,87.63 IC2.4 | v28.42,43.66 28.42,45.09 27.78,45.72 IC8.4
  Top 0.406: IC5.11 19.53,75.56 19.56,75.53 C20.1 | C12.1 19.02,87.47 v17.78,87.47
  Top 0.61: C6.+ 3.48,96.52 v4.76,96.52 4.76,98.06 L1.1 | C20.1 20.99,75.56 v22.86,75.56 | v11.11,65.41 11.15,65.37 C23.1 | v26.99,104.14 C2.1 25.68,103.6 IC1.16 | v23.02,55.72 23.3,55.44 C29.1 | v28.42,43.66 | v28.42,43.66 C32.1 | v31.11,79.38 R21.1
  Supplies 0.61: v22.86,75.56 26.67,79.38 v31.11,79.38 34.92,83.19 34.92,85.72 | v17.78,87.47 19.53,85.72 34.92,85.72 | 34.92,85.72 34.92,96.52 33.02,98.42 30.16,98.42 26.99,101.6 | 26.99,101.6 19.68,101.6 16.51,98.42 6.67,98.42 v4.76,96.52 6.03,95.25 6.03,75.88 11.11,70.8 v11.11,65.41 20.48,56.04 | 26.99,101.6 v26.99,104.14 | v28.42,43.66 20.48,51.59 20.48,56.04 | 20.48,56.04 | 20.48,56.04 22.7,56.04 v23.02,55.72 | v23.02,55.72
VEE  (via drill 0.6)
  Top 0.254: IC7.11 32.73,56.07 C28.2
  Top 0.305: 26.19,87.63 IC2.11 27.27,87.63 C11.2 | IC6.11 20.44,64.77 C24.2 20.67,64.61 21.27,64.61 21.91,63.98 v21.91,63.02 | IC8.11 | IC8.11 31.27,45.72 30.48,44.93 v30.48,43.66
  Top 0.406: IC5.6 13.88,75.53 | C7.2 26.41,92.42 IC1.9
  Top 0.61: C10.- 5.73,88.28 | R19.1 5.73,86.39 C10.- | C10.- 5.71,89.71 5.71,92.71 6.08,93.08 L2.1 | C10.- 5.89,89.53 v7.62,89.53 | v10.79,75.56 12.03,75.56 C19.2 12.1,75.56 IC5.6 | v34.29,54.93 34.45,55.09 C28.2 | v25.24,92.39 C7.2 | v28.57,87.63 28.54,87.67 C11.2 | D2.A 5.73,88.91 C10.- | v30.48,43.66 30.16,43.34 C33.2
  Supplies 0.61: v7.62,89.53 7.62,78.26 10.32,75.56 v10.79,75.56 20.32,66.04 20.32,63.02 | 20.32,63.02 20.32,60.64 22.23,58.74 23.5,58.74 26.04,56.2 26.04,54.93 | 20.32,63.02 v21.91,63.02 | v7.62,89.53 7.78,89.53 | v7.62,89.53 8.26,90.17 25.24,90.17 | 25.24,90.17 v25.24,92.39 | 25.24,90.17 27.78,87.63 v28.57,87.63 | 26.04,54.93 v34.29,54.93 | 26.04,54.93 26.04,53.5 29.84,49.69 29.84,44.13 30.32,43.66 v30.48,43.66

### Text on the board
bPlace: Red stripe
bNames: +12V | GND | GND | GND | -12V | 2019 v9 | cc-by-sa Émilie Gillet | Ripples
tStop: Ripples | cc-by-sa Émilie Gillet | 2019 v9